# Altium schematic sheet Sensor_Board_Schematic.SchDoc
size A
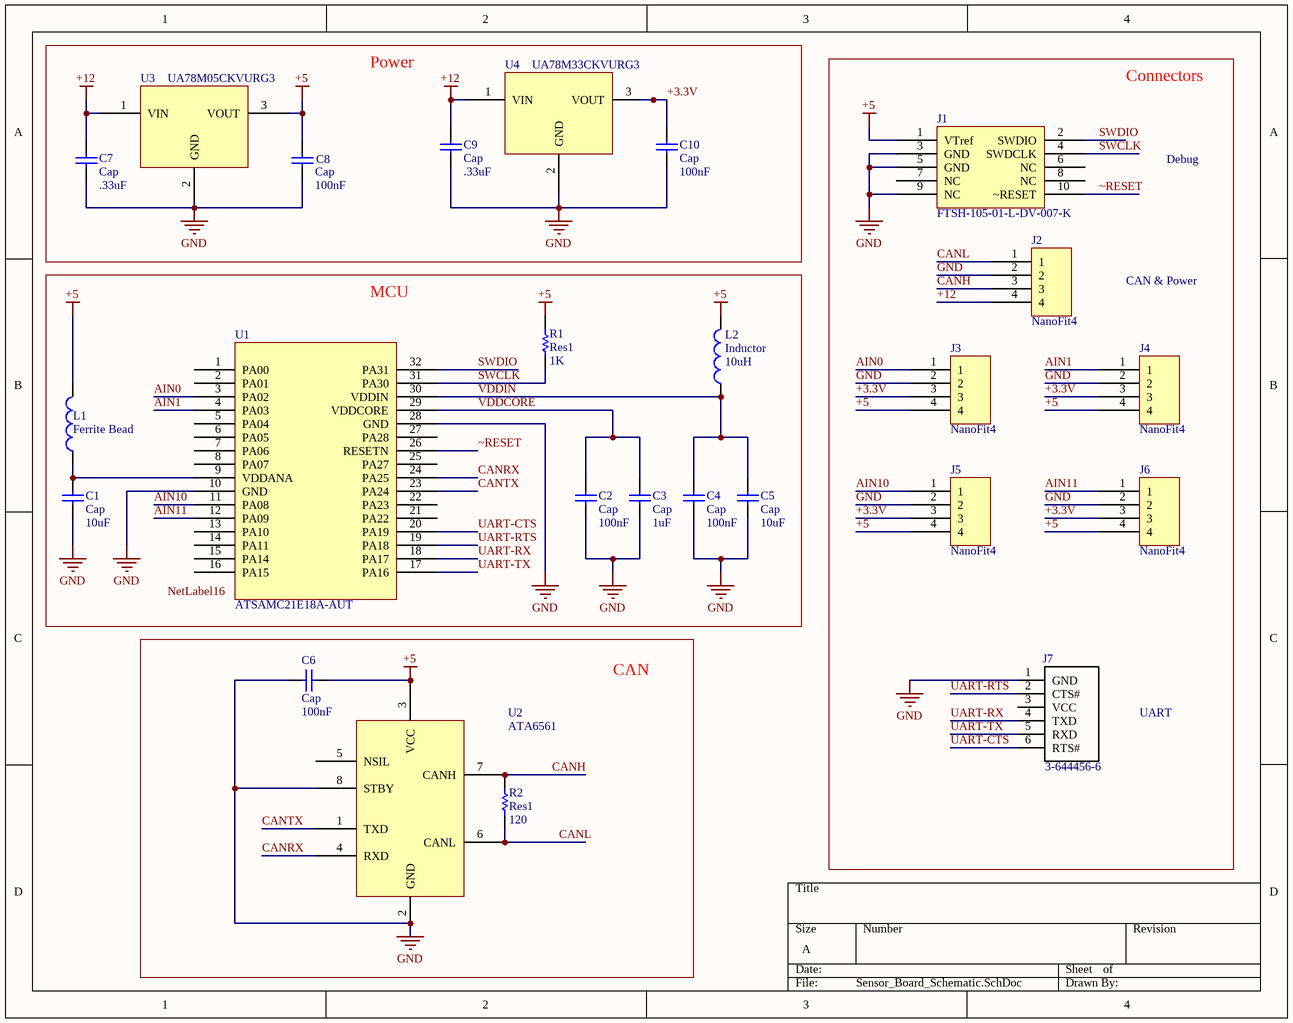
[diagram p0: Sensor_Board_Schematic.SchDoc]

## Parts
C1  Cap  value 10uF  [CAPC1608X08N]
C2  Cap  value 100nF  [CAPC1608X08N]
C3  Cap  value 1uF  [CAPC1608X08N]
C4  Cap  value 100nF  [CAPC1608X08N]
C5  Cap  value 10uF  [CAPC1608X08N]
C6  Cap  value 100nF  [CAPC1608X08N]
C7  Cap  value .33uF  [CAPC1608X08N]
C8  Cap  value 100nF  [CAPC1608X08N]
C9  Cap  value .33uF  [CAPC1608X08N]
C10  Cap  value 100nF  [CAPC1608X08N]
J1  FTSH-105-01-L-DV-007-K  [FTSH-105-01-L-DV-007-K]
J2  NanoFit4  [1053141304]
J3  NanoFit4  [1053141304]
J4  NanoFit4  [1053141304]
J5  NanoFit4  [1053141304]
J6  NanoFit4  [1053141304]
J7  3-644456-6  [*TE_3-644456-6]
L1  Ferrite Bead  [INDC2012X11N]
L2  Inductor  value 10uH  [INDC2016X18N]
R1  Res1  value 1K  [RESC1608X06N]
R2  Res1  value 120  [RESC1608X06N]
U1  ATSAMC21E18A-AUT  [TQFP80P900X900X120-32N]
U2  ATA6561  [SOIC127P600X175-8N]
U3  UA78M05CKVURG3  [DPAK229P991X252-3N]
U4  UA78M33CKVURG3  [DPAK229P991X252-3N]

## Blocks framed on the sheet
Power: C7-C10 U3 U4
Connectors: J1-J7
MCU: C1-C5 L1 L2 R1 U1
CAN: C6 R2 U2

## Nets
+5: C6.1 C8.1 J1.1(VTref) J3.4 J4.4 J5.4 J6.4 L1.2 L2.2 R1.2 U2.3(VCC) U3.3(VOUT)
+12: C7.1 C9.2 J2.4 U3.1(VIN) U4.1(VIN)
GND: C1.1 C2.1 C3.1 C4.1 C5.1 C6.2 C7.2 C8.2 C9.1 C10.1 J1.3(GND) J1.5(GND) J1.9(NC) J2.2 J3.2 J4.2 J5.2 J6.2 J7.1(GND) U1.10(GND) U1.28(GND) U2.2(GND) U2.8(STBY) U3.2(GND) U4.2(GND)
+3.3V: C10.2 J3.3 J4.3 J5.3 J6.3 U4.3(VOUT)
AIN0: J3.1 U1.3(PA02)
AIN1: J4.1 U1.4(PA03)
AIN10: J5.1 U1.11(PA08)
AIN11: J6.1 U1.12(PA09)
CANH: J2.3 R2.2 U2.7(CANH)
CANL: J2.1 R2.1 U2.6(CANL)
CANRX: U1.24(PA25) U2.4(RXD)
CANTX: U1.23(PA24) U2.1(TXD)
SWCLK: J1.4(SWDCLK) R1.1 U1.31(PA30)
SWDIO: J1.2(SWDIO) U1.32(PA31)
UART-CTS: J7.6(RTS#) U1.20(PA19)
UART-RTS: J7.2(CTS#) U1.19(PA18)
UART-RX: J7.4(TXD) U1.18(PA17)
UART-TX: J7.5(RXD) U1.17(PA16)
VDDCORE: C2.2 C3.2 U1.29(VDDCORE)
VDDIN: C4.2 C5.2 L2.1 U1.30(VDDIN)
~RESET: J1.10(~RESET) U1.26(RESETN)
NetC1_2: C1.2 L1.1 U1.9(VDDANA)

Not connected (* = marked no-connect by the designer): J1 6(NC) 7(NC) 8(NC); J7 3(VCC); U1 1(PA00) 2(PA01) 5(PA04) 6(PA05) 7(PA06) 8(PA07) 13(PA10) 14(PA11) 15(PA14) 16(PA15) 21(PA22) 22(PA23) 25(PA27) 27(PA28); U2 5(NSIL)

## Notes on the sheet
- Debug
- CAN & Power
- UART
- Labels drawn without touching a wire or pin: NetLabel16

## Library data of the parts
C1-C10 = Cap: Capacitor; Published: 8-Jun-2000; LatestRevisionDate: 17-Jul-2002; LatestRevisionNote: Re-released for DXP Platform.; PackageReference: RAD-0.3; Publisher: Altium Limited; PackageDescription: Radial Cap, Thru-Hole; 2 Leads; 0.3 in Pin Spacing
L1 = Inductor: Code_IEC: 1005; Value: 10mH; Published: 8-Jun-2000; LatestRevisionDate: 29-May-2009; LatestRevisionNote: IPC-7351 Footprint Added.; PackageReference: 0402-A; Publisher: Altium Limited; PackageDescription: Chip Inductor; Code_JEITA: 0402
L2 = Inductor: Code_IEC: 1005; Published: 8-Jun-2000; LatestRevisionDate: 29-May-2009; LatestRevisionNote: IPC-7351 Footprint Added.; PackageReference: 0402-A; Publisher: Altium Limited; PackageDescription: Chip Inductor; Code_JEITA: 0402
R1 R2 = Res1: Resistor; Published: 8-Jun-2000; LatestRevisionDate: 17-Jul-2002; LatestRevisionNote: Re-released for DXP Platform.; PackageReference: AXIAL-0.3; Publisher: Altium Limited; PackageDescription: Axial Device, Thru-Hole; 2 Leads; 0.3 in Pin Spacing
U3 = UA78M05CKVURG3: pin to pad: 2>4
U4 = UA78M33CKVURG3: pin to pad: 2>4
J7 = 3-644456-6: Value: *